# Altium schematic sheet Sheet2.SchDoc
size A4; SheetNumber: 1; SheetTotal: 1
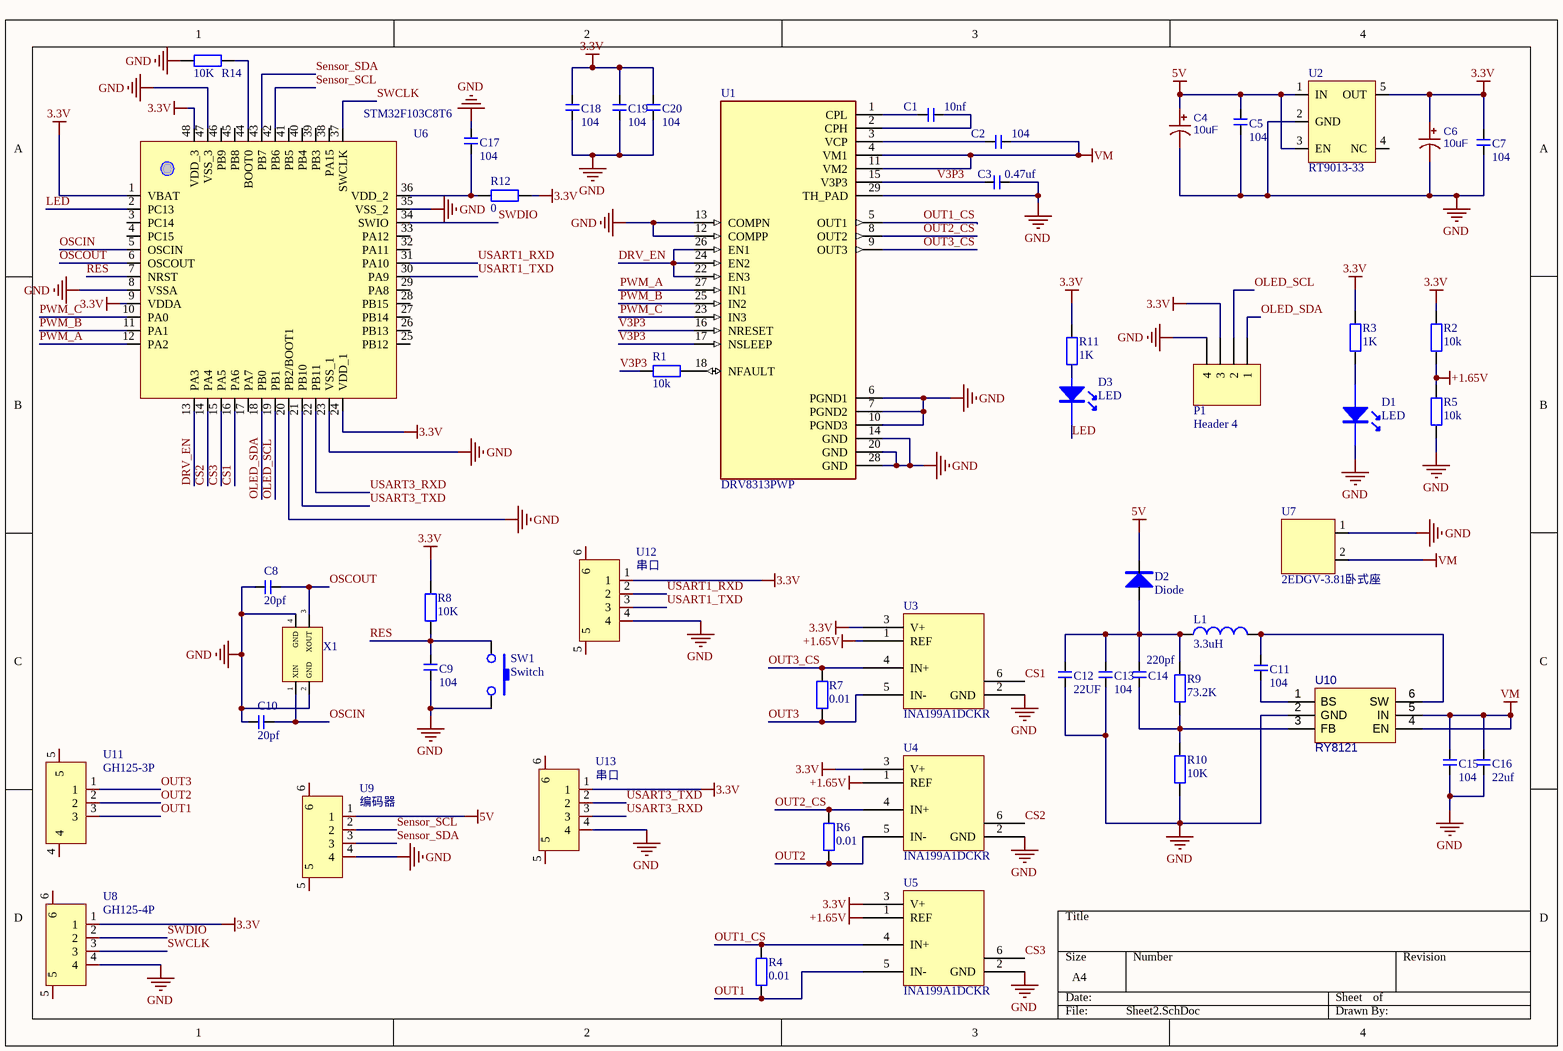
[diagram p0: Sheet2.SchDoc]

## Parts
C1  10nf  [C0603]
C2  104  [C0603]
C3  0.47uf  [C0603]
C4  10uF  [CD A(3216)]
C5  104  [C0603]
C6  10uF  [CD A(3216)]
C7  104  [C0603]
C8  20pf  [C0603]
C9  104  [C0603]
C10  20pf  [C0603]
C11  104  [C0402]
C12  22UF  [C0402]
C13  104  [C0402]
C14  220pf  [C0402]
C15  104  [C0402]
C16  22uf  [C0402]
C17  104  [C0603]
C18  104  [C0603]
C19  104  [C0603]
C20  104  [C0603]
D1  LED  [LED0402]
D2  Diode  [ESC_L1.2-W0.8-LS1.6-RD]
D3  LED  [LED0402]
L1  3.3uH  [0402 TPC 4*4*2]
P1  Header 4  [HDR1X4]
R1  10k  [R0603]
R2  10k  [R0603]
R3  1K  [R0402]
R4  0.01  [R1206]
R5  10k  [R0603]
R6  0.01  [R1206]
R7  0.01  [R1206]
R8  10K  [R0603]
R9  73.2K  [R0603]
R10  10K  [R0603]
R11  1K  [R0402]
R12  0  [R0603]
R14  10K  [R0603]
SW1  Switch  [SW-SMD_L3.9-W3.6-LS4.8-EH]
U1  DRV8313PWP  [HTSSOP-28]
U2  RT9013-33  [SOT-23-5_L2.9-W1.6-P0.95-LS2.8-BR]
U3  INA199A1DCKR  [SOT363]
U4  INA199A1DCKR  [SOT363]
U5  INA199A1DCKR  [SOT363]
U6  STM32F103C8T6  [48P]
U7  2EDGV-3.81卧式座  [2EDGV-3.81卧式座]
U8  GH125-4P  [CONN-SMD_4P-P1.27_GH125-S04DCA-00]
U9  编码器  [CONN-SMD_4P-P1.27_GH125-S04DCA-00]
U10  RY8121  [SOT-23-6]
U11  GH125-3P  [CONN-SMD_3P-P1.27_JS_GH125-S03CCA-00]
U12  串口  [CONN-SMD_4P-P1.27_GH125-S04DCA-00]
U13  串口  [CONN-SMD_4P-P1.27_GH125-S04DCA-00]
X1  XTAL-4  [OSC-SMD_4P-L3.2-W2.5-BL]  (value not drawn)

## Nets
3.3V: C6.1 C7.2 C18.1 C19.1 C20.1 P1.3 R2.2 R3.1 R8.2 R11.1 R12.2 U2.5(OUT) U3.3(V+) U4.3(V+) U5.3(V+) U6.1(VBAT) U6.9(VDDA) U6.24(VDD_1) U6.48(VDD_3) U8.1 U12.1 U13.1
5V: C4.1 C5.2 D2.1 U2.1(IN) U2.3(EN) U9.1
+1.65V: R2.1 R5.2 U3.1(REF) U4.1(REF) U5.1(REF)
GND: C3.2 C4.2 C5.1 C6.2 C7.1 C8.1 C9.2 C10.1 C12.1 C13.1 C15.1 C16.1 C17.1 C18.2 C19.2 C20.2 D1.N P1.4 R5.1 R10.1 R14.1 SW1.2 U1.6(PGND1) U1.7(PGND2) U1.10(PGND3) U1.12(COMPP) U1.13(COMPN) U1.14(GND) U1.20(GND) U1.28(GND) U1.29(TH_PAD) U2.2(GND) U3.2(GND) U4.2(GND) U5.2(GND) U6.8(VSSA) U6.20(PB2/BOOT1) U6.23(VSS_1) U6.35(VSS_2) U6.47(VSS_3) U7.1 U8.4 U9.4 U10.2(GND) U12.4 U13.4 X1.2(GND) X1.4(GND)
VM: C2.1 C15.2 C16.2 U1.4(VM1) U1.11(VM2) U7.2 U10.4(EN) U10.5(IN)
CS1: U3.6 U6.16(PA6)
CS2: U4.6 U6.14(PA4)
CS3: U5.6 U6.15(PA5)
DRV_EN: U1.22(EN3) U1.24(EN2) U1.26(EN1) U6.13(PA3)
LED: D3.N U6.2(PC13)
OLED_SCL: P1.2 U6.19(PB1)
OLED_SDA: P1.1 U6.18(PB0)
OSCIN: C10.2 U6.5(OSCIN) X1.1(XIN)
OSCOUT: C8.2 U6.6(OSCOUT) X1.3(XOUT)
OUT1: R4.1 U5.5(IN-) U11.3
OUT1_CS: R4.2 U1.5(OUT1) U5.4(IN+)
OUT2: R6.1 U4.5(IN-) U11.2
OUT2_CS: R6.2 U1.8(OUT2) U4.4(IN+)
OUT3: R7.1 U3.5(IN-) U11.1
OUT3_CS: R7.2 U1.9(OUT3) U3.4(IN+)
PWM_A: U1.27(IN1) U6.12(PA2)
PWM_B: U1.25(IN2) U6.11(PA1)
PWM_C: U1.23(IN3) U6.10(PA0)
RES: C9.1 R8.1 SW1.1 U6.7(NRST)
Sensor_SCL: U6.42(PB6) U9.2
Sensor_SDA: U6.43(PB7) U9.3
SWCLK: U6.37(SWCLK) U8.3
SWDIO: U6.34(SWIO) U8.2
USART1_RXD: U6.31(PA10) U12.2
USART1_TXD: U6.30(PA9) U12.3
USART3_RXD: U6.22(PB11) U13.3
USART3_TXD: U6.21(PB10) U13.2
V3P3: C3.1 R1.1 U1.15(V3P3) U1.16(NRESET) U1.17(NSLEEP)
NetC1_1: C1.1 U1.2(CPH)
NetC1_2: C1.2 U1.1(CPL)
NetC2_2: C2.2 U1.3(VCP)
NetC11_1: C11.1 U10.1(BS)
NetC11_2: C11.2 L1.2 U10.6(SW)
NetC12_2: C12.2 C13.2 C14.2 D2.2 L1.1 R9.2
NetC14_1: C14.1 R9.1 R10.2 U10.3(FB)
NetC17_2: C17.2 R12.1 U6.36(VDD_2)
NetD1_A: D1.A R3.2
NetD3_A: D3.A R11.2
NetR1_2: R1.2 U1.18(NFAULT)
NetR14_2: R14.2 U6.44(BOOT0)

Not connected (* = marked no-connect by the designer): U2 4(NC); U6 3(PC14) 4(PC15) 17(PA7) 25(PB12) 26(PB13) 27(PB14) 28(PB15) 29(PA8) 32(PA11) 33(PA12) 38(PA15) 39(PB3) 40(PB4) 41(PB5) 45(PB8) 46(PB9); U8 5 6; U9 5 6; U11 4 5; U12 5 6; U13 5 6

## Library data of the parts
C1-C3 C5 C7-C20 = C: 无极性电容; BOM名称: 无极性贴片电容; 版权归属: 源创客; 学习资源: www.ooocke.com
C4 C6 = CAP+: 电解电容 10uf  贴片型 钽电容的正极是实物有线的一段; BOM_Manufacturer: ROQANG; BOM_Manufacturer Part: RVT1V100M0405; nameAlias: Capacitance; BOM_Supplier: LCSC; BOM_Supplier Part: C72485; BOM_JLCPCB Part Class: Extended Part; spicePre: C; spiceSymbolName: RVT1V100M0405-C72485
D2 = 二极管: Diode 1N series
L1 = L: 电感; BOM名称: 小功率贴片电感; 版权归属: 源创客; 学习资源: www.ooocke.com
P1 = Header 4: Header, 4-Pin; LatestRevisionDate: 17-Jul-2002; LatestRevisionNote: Re-released for DXP Platform.; Publisher: Altium Limited
R1-R12 R14 = R: 电阻; BOM名称: 贴片电阻; 版权归属: 源创客; 学习资源: www.ooocke.com
U1 = DRV8313PWP: 65-V max, 3-A peak 3-phase motor driver 28-HTSSOP -40 to 125; MF: Texas Instruments; Availability: Good; SnapEDA_Link: https://www.snapeda.com/parts/DRV8313PWP/Texas%20Instruments/view-part/287728/?ref=snap; Price: None; MP: DRV8313PWP; Purchase-URL: https://pricing.snapeda.com/search/part/DRV8313PWP/?ref=eda; Package: HTSSOP-28 Texas Instruments; Value: *
U2 = RT9013-33: 3.3V降压 500mA 最大输入5.5V
U9 U12 U13 = GH125-4P
U10 = RY8121: 18V 2A 1MHz Synchronous Step-Down Regulator
X1 = XTAL-4: 贴片晶振